# Altium schematic sheet 10_Wifi.SchDoc
size A4
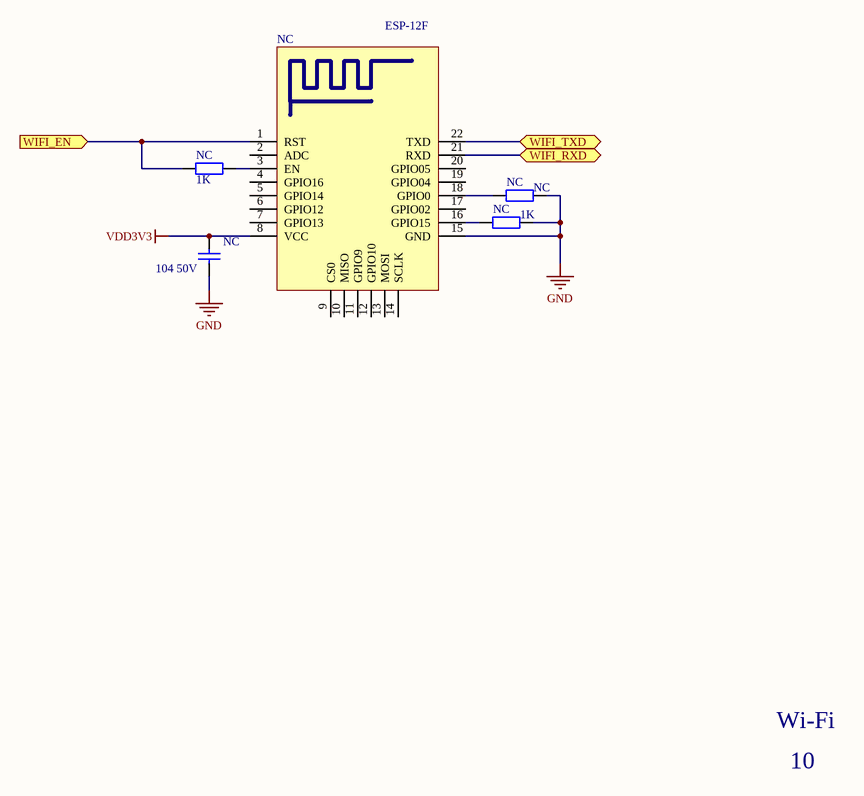
[diagram p0: 10_Wifi.SchDoc]

## Parts
(Parts that share a designator on the sheet are numbered #1, #2 ... from top to bottom, then left to right.)
NC#1  ESP-12F  [ESP-12F]
NC#2  1K  [SMD-0603]
NC#3  NC  [SMD-0603]
NC#4  1K  [SMD-0603]
NC#5  104 50V  [SMD-0603C]

## Ports
WIFI_EN (in), WIFI_RXD (bidir), WIFI_TXD (bidir)

## Nets
GND: NC#1.15(GND) NC#3.1 NC#4.2 NC#5.1
VDD3V3: NC#1.8(VCC) NC#5.2
WIFI_EN: NC#1.1(RST) NC#2.1 ; port WIFI_EN
WIFI_RXD: NC#1.21(RXD) ; port WIFI_RXD
WIFI_TXD: NC#1.22(TXD) ; port WIFI_TXD
NetNC#1_3: NC#1.3(EN) NC#2.2
NetNC#1_16: NC#1.16(GPIO15) NC#4.1
NetNC#1_18: NC#1.18(GPIO0) NC#3.2

Not connected (* = marked no-connect by the designer): NC#1 2(ADC) 4(GPIO16) 5(GPIO14) 6(GPIO12) 7(GPIO13) 9(CS0) 10(MISO) 11(GPIO9) 12(GPIO10) 13(MOSI) 14(SCLK) 17(GPIO02) 19(GPIO04) 20(GPIO05)

## Notes on the sheet
- Wi-Fi
- 10

## Library data of the parts
NC#1 = ESP8266
NC#2-NC#4 = RES2: 贴片电阻 5%
NC#5 = CAP4: 贴片电容 20%